# EAGLE schematic Wiring (EAGLE 8.3.2)
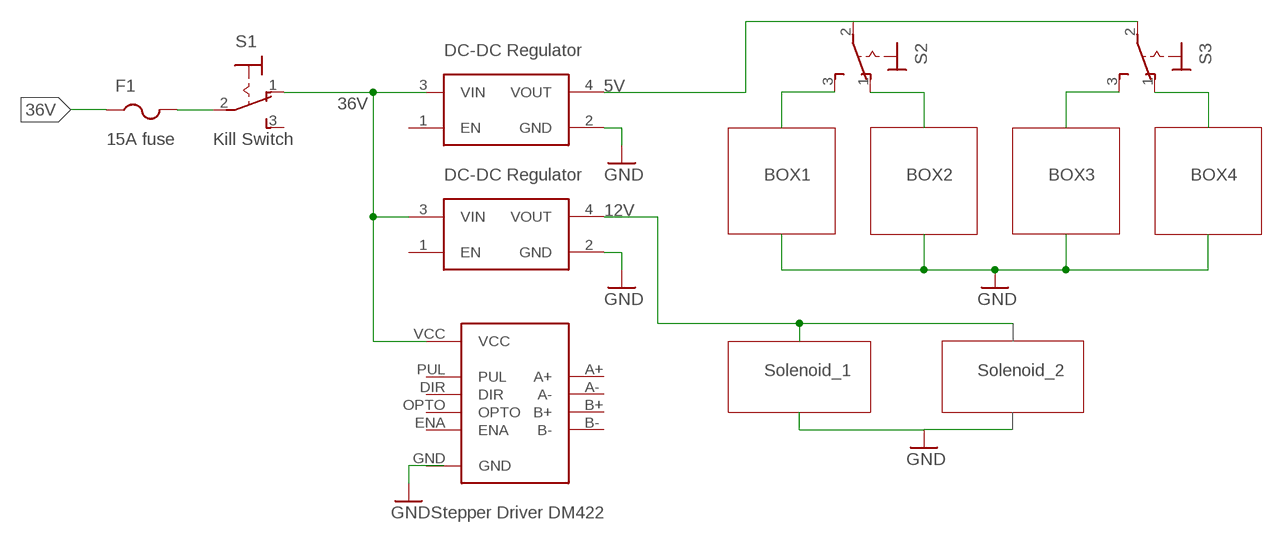
[diagram p0: schematic, sheet 1]

## Parts
F1  PTCFUSE-1206  [R1206]
S1  320-916  [320-916]
S2  M9040P  [M9040P]
S3  M9040P  [M9040P]
U$1  REGULATOR  [TO3-4]
U$2  REGULATOR  [TO3-4]
U$3  DM422  [DIL14]

## Nets
5V: S2.3(S) S3.1(O)
36V: F1.1 S1.1(O) U$2.3(VIN) U$3.VCC
GND: U$1.2(GND) U$2.2(GND)
N$1: F1.2 S1.2(P)
N$3: S2.1(O)
N$5: S3.3(S)
N$6: U$2.4(VOUT)
N$7: S2.2(P) S3.2(P) U$1.4(VOUT)
Unconnected: S1.3(S) U$1.1(EN) U$1.3(VIN) U$2.1(EN) U$3.A+ U$3.A- U$3.B+ U$3.B- U$3.DIR U$3.ENA U$3.OPTO U$3.PUL

## Notes on the sheet
- 15A fuse | Kill Switch
- BOX1 | BOX2 | BOX3 | BOX4
- 12V
- Solenoid_1 | Solenoid_2

## Power pins joined to a net without a drawn wire
GND: U$3.GND

## Library data of the parts
F1 = adafruit:PTCFUSE: PTC fuses, resettable thermistors
S1 = switch:320-916: TOGGLE SWITCH distributor RS Components
S2 S3 = switch:M9040P: TOGGLE SWITCH Marquardt
U$1 U$2 = dc-dcRegulator:REGULATOR
U$3 = DM422 Stepper Driver :DM422: DM422 Stepper Driver: This is only a dummy schematic symbol to show connections to MCU.